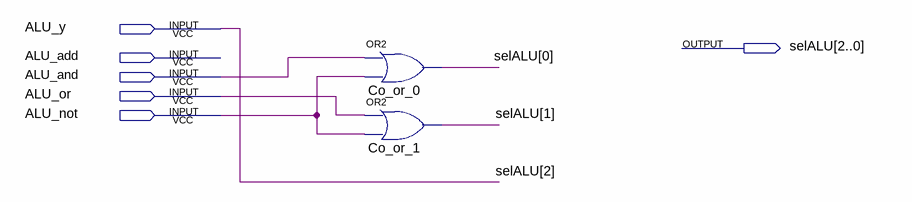
[diagram p0: schematic sheet]
// Quartus schematic alu_encoder.bdf as structural Verilog: 2 symbols, 6 pins
module alu_encoder (
  input  ALU_y,
  input  ALU_add,
  input  ALU_and,
  input  ALU_or,
  input  ALU_not,
  output [2:0] selALU
);

  or Co_or_0 (selALU[0], ALU_and, ALU_not);
  or Co_or_1 (selALU[1], ALU_or, ALU_not);

  assign selALU[2] = ALU_y;
endmodule
